# EasyEDA Pro project New Project_2024-09-24_23-01-51.eprj

# Schematic Schematic1
Create Date: 2024-09-24; Page Name: P1; Project Name: New Project_2024-09-24_23-01-51; Schematic Name: Schematic1; Update Date: 2024-09-25; Company: 嘉立创EDA; Page Size: A4; Version: V1.0
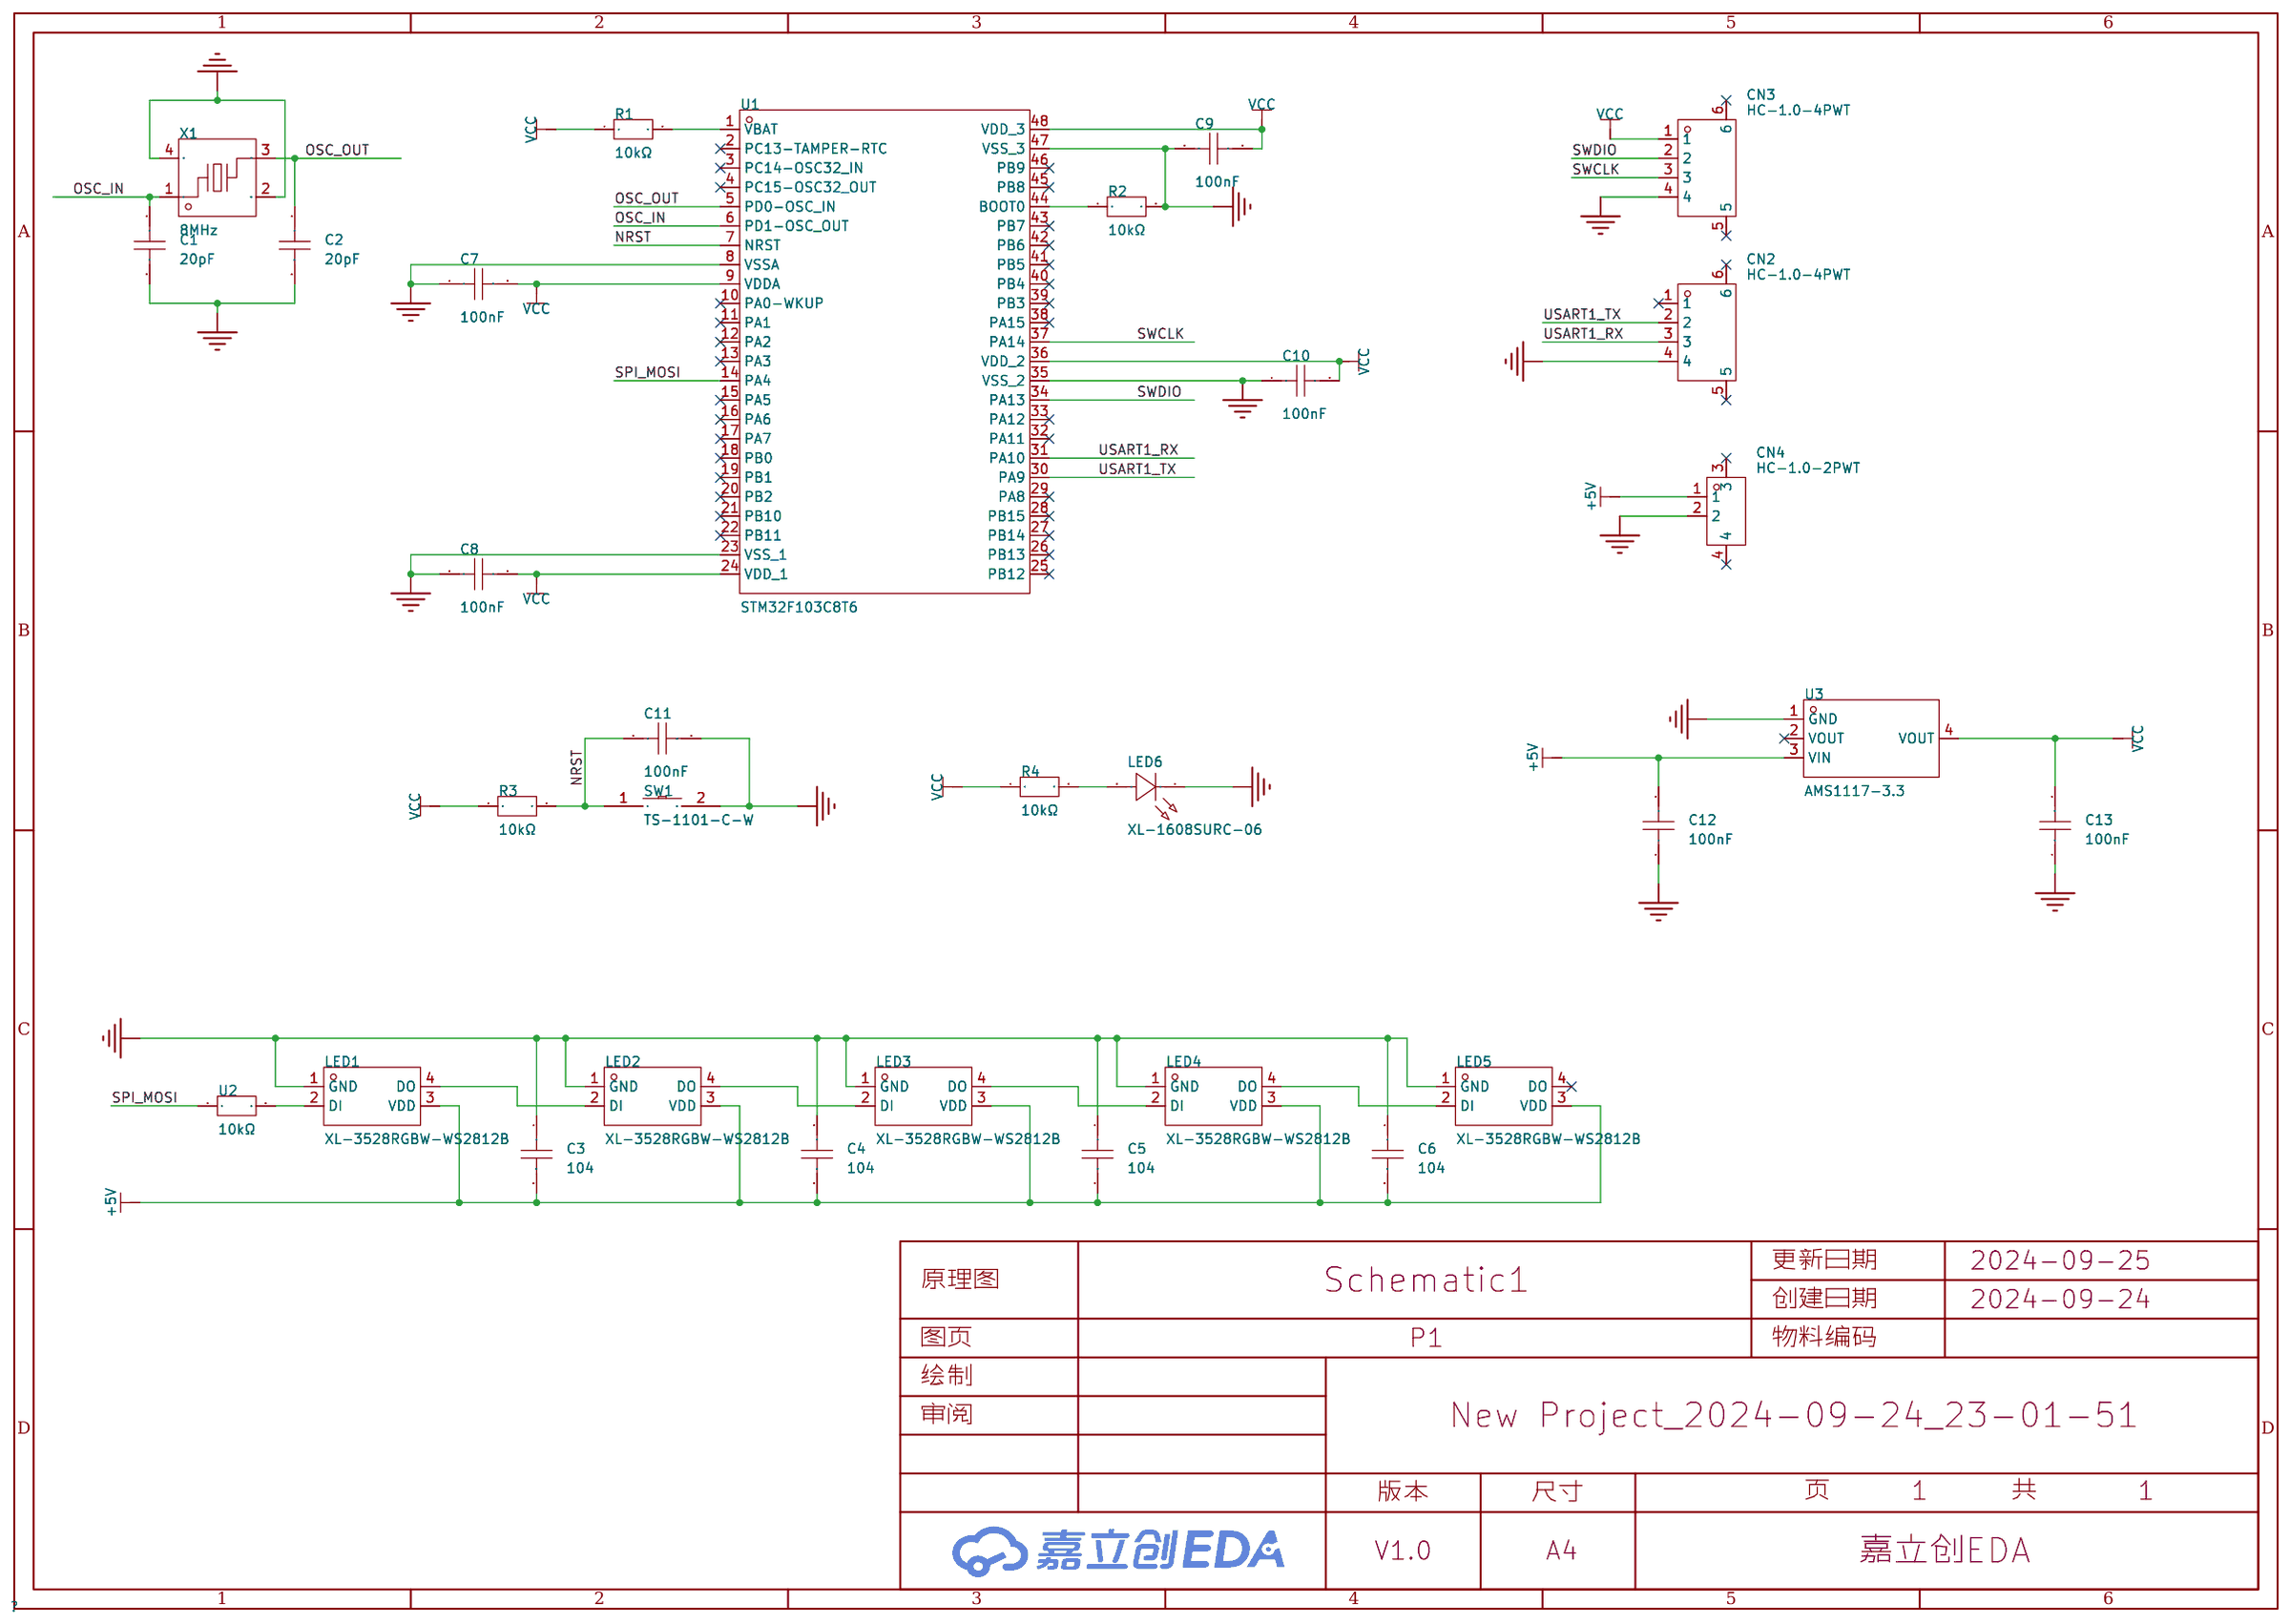
[diagram p0: schematic sheet]

## Parts
C1  20pF  [C0603]
C2  20pF  [C0603]
C3  104  [C0603]
C4  104  [C0603]
C5  104  [C0603]
C6  104  [C0603]
C7  100nF  [C0603]
C8  100nF  [C0603]
C9  100nF  [C0603]
C10  100nF  [C0603]
C11  100nF  [C0603]
C12  100nF  [C0603]
C13  100nF  [C0603]
CN2  HC-1.0-4PWT  [CONN-SMD_4P-P1.00_HCTL_HC-1.0-4PWT]
CN3  HC-1.0-4PWT  [CONN-SMD_4P-P1.00_HCTL_HC-1.0-4PWT]
CN4  HC-1.0-2PWT  [CONN-SMD_HC-1.0-2PWT]
LED1  XL-3528RGBW-WS2812B  [LED-SMD_4P-L3.5-W2.8-BR-1]
LED2  XL-3528RGBW-WS2812B  [LED-SMD_4P-L3.5-W2.8-BR-1]
LED3  XL-3528RGBW-WS2812B  [LED-SMD_4P-L3.5-W2.8-BR-1]
LED4  XL-3528RGBW-WS2812B  [LED-SMD_4P-L3.5-W2.8-BR-1]
LED5  XL-3528RGBW-WS2812B  [LED-SMD_4P-L3.5-W2.8-BR-1]
LED6  XL-1608SURC-06  [LED0603-RD_RED]
R1  10kΩ  [R0603]
R2  10kΩ  [R0603]
R3  10kΩ  [R0603]
R4  10kΩ  [R0603]
SW1  TS-1101-C-W  [SW-SMD_L6.0-W3.3-LS8.0]
U1  STM32F103C8T6  [LQFP-48_L7.0-W7.0-P0.50-LS9.0-BL]
U2  10kΩ  [R0603]
U3  AMS1117-3.3  [SOT-223-3_L6.5-W3.4-P2.30-LS7.0-BR]
X1  8MHz  [OSC-SMD_4P-L3.2-W2.5-BL]

## Library data of the parts
C1-C13 = CGA0603X7R104K500JT: 容值:100nF;精度:±10%;额定电压:50V;材质(温度系数):X7R;; LCSC Part Name: 100nF ±10% 50V; Supplier Part: C6119867; Manufacturer: HRE(芯声); Supplier Footprint: 0603; Supplier: LCSC; Tolerance: ±10%; Voltage Rated: 50V; Temperature Coefficient: X7R
CN2 CN3 = HC-1.0-4PWT: 插针结构:1x4P;间距:1mm;安装方式:卧贴;参考系列:-;总PIN数:4P;排数:1;每排PIN数:4;行距:-;额定电流:1A;触头材质:磷青铜;触头镀层:锡;工作温度范围:-25℃~+85℃;; LCSC Part Name: 1x4P 间距:1mm 卧贴; Supplier Part: C2845363; Manufacturer: HCTL(华灿天禄); Supplier Footprint: SMD,P=1mm,卧贴; Datasheet: https://atta.szlcsc.com/upload/public/pdf/source/20230707/696F47DD5B3D5495B4AB8BCE302E8A84.pdf; Supplier: LCSC; Pins Structure: 1x4P; Pitch: 1mm; Mounting Style: 卧贴; Number of Pins: 4P; Number of Rows: 1; Number of PINs Per Row: 4; Current Rating (Max): 1A; Contact Material: 磷青铜; Contact Plating: 锡; Operating Temperature Range: -25℃~+85℃
CN4 = HC-1.0-2PWT: 插针结构:1x2P;间距:1mm;安装方式:卧贴;参考系列:-;总PIN数:2P;排数:1;每排PIN数:2;行距:-;额定电流:1A;触头材质:磷青铜;触头镀层:锡;工作温度范围:-25℃~+85℃;; LCSC Part Name: 1x2P 间距:1mm 卧贴; Supplier Part: C2845361; Manufacturer: HCTL(华灿天禄); Supplier Footprint: SMD,P=1mm,卧贴; Datasheet: https://atta.szlcsc.com/upload/public/pdf/source/20230707/696F47DD5B3D5495B4AB8BCE302E8A84.pdf; Supplier: LCSC; Pins Structure: 1x2P; Pitch: 1mm; Mounting Style: 卧贴; Number of Pins: 2P; Number of Rows: 1; Number of PINs Per Row: 2; Current Rating (Max): 1A; Contact Material: 磷青铜; Contact Plating: 锡; Operating Temperature Range: -25℃~+85℃
LED1-LED5 = XL-3528RGBW-WS2812B: 3528 七彩幻彩雾状 ws2812B 内置驱动IC; Supplier Part: C2890364; Manufacturer: XINGLIGHT(成兴光); Supplier Footprint: SMD3528-4P; Datasheet: https://atta.szlcsc.com/upload/public/pdf/source/20240218/041E1E0D0024617DFFF124D9C311BB4D.pdf; Supplier: LCSC
LED6 = XL-1608SURC-06: 发光颜色:红色;功率:55mW;正向电流:25mA;主波长:617nm~621nm;透镜颜色:无色透明透镜;色温:-;发光角度:120°;载带方式:正贴;工作温度:-30℃~+85℃;; Supplier Part: C965799; Manufacturer: XINGLIGHT(成兴光); Supplier Footprint: 0603; Datasheet: https://atta.szlcsc.com/upload/public/pdf/source/20221102/D860AFDD1CDB02C5A8064103A32707E2.pdf; Supplier: LCSC; Emitted Color: 红色; Power Dissipation: 55mW; Forward Current: 25mA; Dominant Wavelength: 617nm~621nm; Peak Wavelength: 623nm; Lens Color: 无色透明透镜; Viewing Angle: 120°; Mounting Sytle: 正贴; Operating Temperature: -30℃~+85℃
R1-R4 = FRC0603J472 TS: 电阻类型:厚膜电阻;阻值:4.7kΩ;精度:±5%;功率:100mW;最大工作电压:75V;温度系数:±100ppm/℃;; LCSC Part Name: 4.7kΩ ±5% 100mW 厚膜电阻; Supplier Part: C2907166; Manufacturer: FOJAN(富捷); Supplier Footprint: 0603; Datasheet: https://atta.szlcsc.com/upload/public/pdf/source/20211221/925EC7D7225764EE0046F22065062C87.pdf; Supplier: LCSC; Type: 厚膜电阻; Tolerance: ±5%; Power(Watts): 100mW; Overload Voltage (Max): 75V; Temperature Coefficient: ±100ppm/℃; Operating Temperature Range: -55℃~+155℃
SW1 = TS-1101-C-W: 电路结构:单刀单掷;按钮形状:矩形按钮;作用力:260gf;安装方式:立贴;开关长度:6mm;开关宽度:3.6mm;开关高度:2.5mm;带支架:不带;触点电流:50mA;额定电压(AC):-;额定电压(DC):12V;额定功率:-;绝缘电阻:-;带灯:无;机械寿命:5万次;; LCSC Part Name: 6*3.6*2.5mm 立贴 轻触开关; Supplier Part: C318938; Manufacturer: XKB Connectivity(中国星坤); Supplier Footprint: SMD; Datasheet: https://atta.szlcsc.com/upload/public/pdf/source/20200227/C318938_C2E53B1EEDE37D980A33616AC086DE53.pdf; Supplier: LCSC; Circuit: 单刀单掷; Actuator Style: 矩形按钮; Operating Force: 260gf; Mounting Style: 立贴; Switch Length: 6mm; Switch Width: 3.6mm; Switch Height: 2.5mm; Strike Gundam: 不带; Contact Current: 50mA; Voltage Rating (DC): 12V; Actuator/Cap Color: 白色带淡绿; With Lamp: 无; Mechanical Life: 5万次; Operating Temperature: -30℃~+85℃
U1 = STM32F103C8T6: CPU内核:ARM-M3;程序存储容量:64KB;RAM总容量:20KB;GPIO端口数量:37;工作电压范围:2V~3.6V;CPU最大主频:72MHz;程序存储器类型:FLASH;; LCSC Part Name: 主流增强型ARM Cortex-M3 MCU，具有64 KB Flash、72 MHz CPU、电机控制、USB和CAN; Supplier Part: C8734; Manufacturer: ST(意法半导体); Supplier Footprint: LQFP-48(7x7); Datasheet: https://atta.szlcsc.com/upload/public/pdf/source/20220812/8363ACEC51AD55ECEB84799464F7CB85.pdf; Supplier: LCSC; CPU Core: ARM-M3; Program Storage Size: 64KB; RAM Size: 20KB; GPIO Ports Number: 37; Operating Voltage Range: 2V~3.6V; CPU Maximum Speed: 72MHz; Program Memory Type: FLASH; Operating Temperature Range: -40℃~+85℃; ADC (Bit): 12bit; Universal Serial Bus: 有; Peripheral/Function: 看门狗；DMA；看门狗；温度传感器; Watchdog: 有; Infrared Data Association: 有; Low-Voltage Detect: 有; Direct Memory Access: 有; Internal Oscillator: 有
U2 = FRC0603F3903TS: 电阻类型:厚膜电阻;阻值:390kΩ;精度:±1%;功率:100mW;最大工作电压:75V;温度系数:±100ppm/℃;; LCSC Part Name: 390kΩ ±1% 100mW 厚膜电阻; Supplier Part: C2907030; Manufacturer: FOJAN(富捷); Supplier Footprint: 0603; Datasheet: https://atta.szlcsc.com/upload/public/pdf/source/20211221/925EC7D7225764EE0046F22065062C87.pdf; Supplier: LCSC; Type: 厚膜电阻; Tolerance: ±1%; Power(Watts): 100mW; Overload Voltage (Max): 75V; Temperature Coefficient: ±100ppm/℃; Operating Temperature Range: -55℃~+155℃
U3 = AMS1117-3.3_C6186: 输出类型:固定;最大输入电压:-;输出电压:3.3V;最大输出电流:1A;电源纹波抑制比(PSRR):72dB@(120Hz);输出极性:正极;; LCSC Part Name: 输出3.3V 1A; Supplier Part: C6186; Manufacturer: AMS; Supplier Footprint: SOT-223; Datasheet: https://atta.szlcsc.com/upload/public/pdf/source/20180727/C6186_7A095716F0823C02F1997A905E26C086.pdf; Supplier: LCSC; Output Type: 固定; Output Voltage: 3.3V; MAX Output Current: 1A; Power Supply Rejection Ratio (PSRR): 72dB@(120Hz); Dropout Voltage: 1.3V@(800mA); Output Polarity: 正极; Number of Outputs: 1
X1 = X32258MOB4SI: 晶振类型:贴片晶振;频率:8MHz;常温频差:±10ppm;外接负载电容:12pF;频率稳定度(全温):±20ppm;; LCSC Part Name: 8MHz ±10ppm 12pF; Supplier Part: C2682775; Manufacturer: YXC(扬兴晶振); Supplier Footprint: SMD3225-4P; Datasheet: https://atta.szlcsc.com/upload/public/pdf/source/20240329/19D5F850207469550BEB00D7DFEDBC7A.pdf; Supplier: LCSC; Crystal Type: 贴片晶振; Normal temperature Frequency Tolerance: ±10ppm; External load capacitor: 12pF; Frequency Stability(Full temperature range): ±20ppm; Equivalent Series Resistance (ESR): 150Ω; Operating Temperature: -40℃~+85℃

## Nets
+5V: C3.2 C4.2 C5.2 C6.2 C12.2 CN4.1 LED1.3(VDD) LED2.3(VDD) LED3.3(VDD) LED4.3(VDD) LED5.3(VDD) U3.3(VIN)
GND: C1.2 C2.2 C3.1 C4.1 C5.1 C6.1 C7.1 C8.1 C9.1 C10.1 C11.2 C12.1 C13.1 CN2.4 CN3.4 CN4.2 LED1.1(GND) LED2.1(GND) LED3.1(GND) LED4.1(GND) LED5.1(GND) LED6.1(K) R2.2 SW1.2 U1.8(VSSA) U1.23(VSS_1) U1.35(VSS_2) U1.47(VSS_3) U3.1(GND) X1.2(GND) X1.4(GND)
VCC: C7.2 C8.2 C9.2 C10.2 C13.2 CN3.1 R1.1 R3.1 R4.1 U1.9(VDDA) U1.24(VDD_1) U1.36(VDD_2) U1.48(VDD_3) U3.4(VOUT)
NRST: C11.1 R3.2 SW1.1 U1.7(NRST)
OSC_IN: C1.1 U1.6(PD1-OSC_OUT) X1.1
OSC_OUT: C2.1 U1.5(PD0-OSC_IN) X1.3
SPI_MOSI: U1.14(PA4) U2.1
SWCLK: CN3.3 U1.37(PA14)
SWDIO: CN3.2 U1.34(PA13)
USART1_RX: CN2.3 U1.31(PA10)
USART1_TX: CN2.2 U1.30(PA9)
$1N1370: LED1.4(DO) LED2.2(DI)
$1N1375: LED2.4(DO) LED3.2(DI)
$1N1387: LED4.4(DO) LED5.2(DI)
$1N1405: LED3.4(DO) LED4.2(DI)
$1N2023: LED1.2(DI) U2.2
$1N3413: R1.2 U1.1(VBAT)
$1N3660: R2.1 U1.44(BOOT0)
Net-(LED6-2): LED6.2(A) R4.2

Not connected (* = marked no-connect by the designer): CN2 1* 5* 6*; CN3 5* 6*; CN4 3* 4*; LED5 4(DO)*; U1 2(PC13-TAMPER-RTC)* 3(PC14-OSC32_IN)* 4(PC15-OSC32_OUT)* 10(PA0-WKUP)* 11(PA1)* 12(PA2)* 13(PA3)* 15(PA5)* 16(PA6)* 17(PA7)* 18(PB0)* 19(PB1)* 20(PB2)* 21(PB10)* 22(PB11)* 25(PB12)* 26(PB13)* 27(PB14)* 28(PB15)* 29(PA8)* 32(PA11)* 33(PA12)* 38(PA15)* 39(PB3)* 40(PB4)* 41(PB5)* 42(PB6)* 43(PB7)* 45(PB8)* 46(PB9)*; U3 2(VOUT)*

# Board PCB1
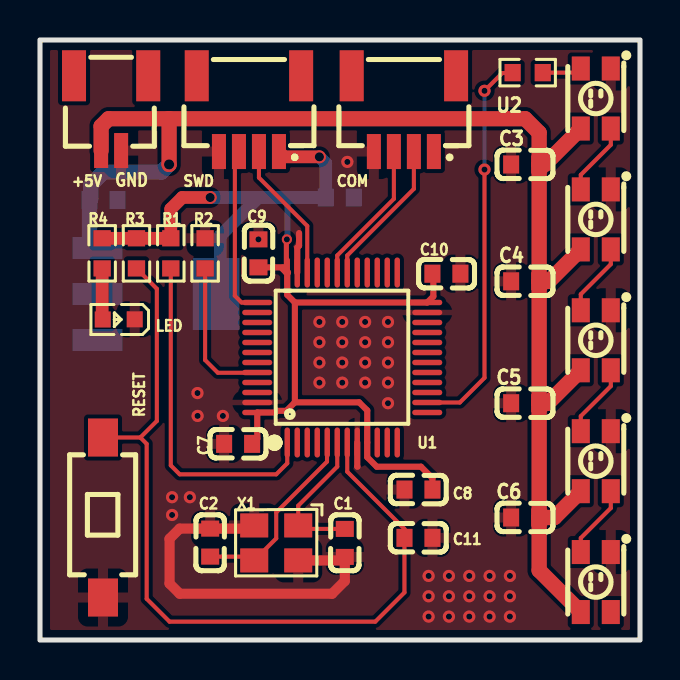
[diagram p1: board, top side]
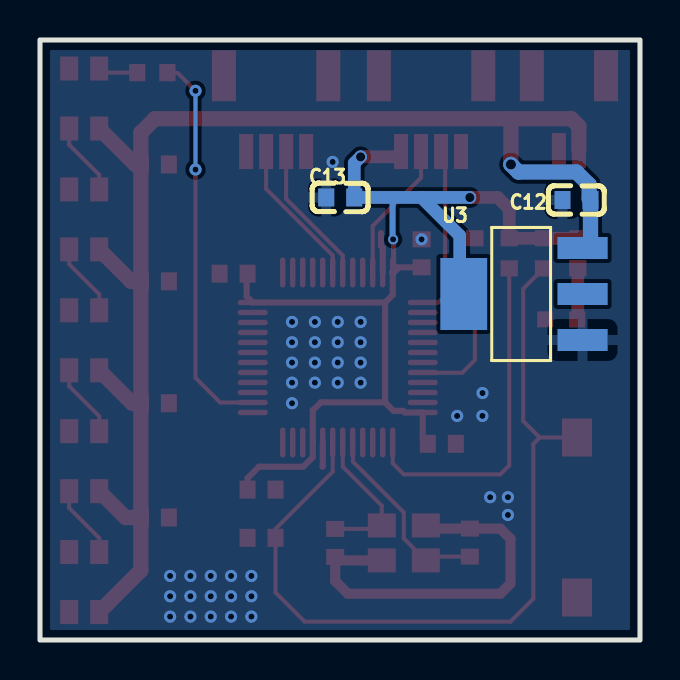
[diagram p2: board, bottom side, seen from below]

Outline 30 x 30 mm; copper layers: Top Layer, Bottom Layer. Coordinates in mm from the lower left corner of the outline.
Outline path: rectangle 0,30 30,0
Stack: Top Layer 0.035mm / Dielectric1 1.51mm FR4 er 4.5 / Bottom Layer 0.035mm

## Design rules (mm)
template: JLCPCB Capability(Two Layers Board)
spacing copperThickness1oz (default): track to track 0.102, other pairs 0.152 to 0.3
spacing copperThickness2oz: track to track 0.203, other pairs 0.152 to 0.3
track width copperThickness1oz (default): min 0.127, default 0.254, max 2.54
track width copperThickness2oz: min 0.203, default 0.254, max 2.54
differential pair differentialPair (default): width min 0.127, default 0.254, max 2.54; gap min 0.152, default 0.152
via viaSize (default): diameter min 0.5, default 0.61, max 10; hole min 0.3, default 0.305, max 6.3

## Placement (name value [footprint] x y rotation side)
+5V  HC-1.0-2PWT  [CONN-SMD_HC-1.0-2PWT]  3.56 26.34 180 top
C1  20pF  [C0603]  15.24 4.85 270 top
C2  20pF  [C0603]  8.51 4.87 90 top
C3  104  [C0603]  24.26 23.78 0 top
C4  104  [C0603]  24.26 17.94 0 top
C5  104  [C0603]  24.26 11.84 0 top
C6  104  [C0603]  24.26 6.12 0 top
C7  100nF  [C0603]  9.91 9.81 0 top
C8  100nF  [C0603]  18.92 7.52 0 top
C9  100nF  [C0603]  10.92 19.33 270 top
C10  100nF  [C0603]  20.32 18.32 180 top
C11  100nF  [C0603]  18.92 5.11 0 top
C12  100nF  [C0603]  3.18 22 180 bottom
C13  100nF  [C0603]  14.99 22.13 180 bottom
COM  HC-1.0-4PWT  [CONN-SMD_4P-P1.00_HCTL_HC-1.0-4PWT]  18.19 26.32 180 top
LED  XL-1608SURC-06  [LED0603-RD_RED]  3.94 16.03 180 top
LED1  XL-3528RGBW-WS2812B  [LED-SMD_4P-L3.5-W2.8-BR-1]  27.79 27.07 90 top
LED2  XL-3528RGBW-WS2812B  [LED-SMD_4P-L3.5-W2.8-BR-1]  27.79 21.03 90 top
LED3  XL-3528RGBW-WS2812B  [LED-SMD_4P-L3.5-W2.8-BR-1]  27.79 14.99 90 top
LED4  XL-3528RGBW-WS2812B  [LED-SMD_4P-L3.5-W2.8-BR-1]  27.79 8.94 90 top
LED5  XL-3528RGBW-WS2812B  [LED-SMD_4P-L3.5-W2.8-BR-1]  27.79 2.9 90 top
R1  10kΩ  [R0603]  6.54 19.33 270 top
R2  10kΩ  [R0603]  8.25 19.33 90 top
R3  10kΩ  [R0603]  4.82 19.33 270 top
R4  10kΩ  [R0603]  3.11 19.33 270 top
RESET  TS-1101-C-W  [SW-SMD_L6.0-W3.3-LS8.0]  3.15 6.12 270 top
SWD  HC-1.0-4PWT  [CONN-SMD_4P-P1.00_HCTL_HC-1.0-4PWT]  10.45 26.32 180 top
U1  STM32F103C8T6  [LQFP-48_L7.0-W7.0-P0.50-LS9.0-BL]  15.11 14.12 0 top
U2  10kΩ  [R0603]  24.38 28.37 0 top
U3  AMS1117-3.3  [SOT-223-3_L6.5-W3.4-P2.30-LS7.0-BR]  5.84 17.3 180 bottom
X1  8MHz  [OSC-SMD_4P-L3.2-W2.5-BL]  11.81 4.85 180 top

## Footprints (pads in the part's own frame, mm; a bottom-side part is the same pattern mirrored in y, then rotated)
C0603
  rect 0.8x0.9 smd: 1(-0.7,0) 2(0.7,0)
CONN-SMD_4P-P1.00_HCTL_HC-1.0-4PWT
  rect 0.7x1.75 smd: 1(-1.5,1.895) 2(-0.5,1.895) 3(0.5,1.895) 4(1.5,1.895)
  rect 1.2x2.55 smd: 5(2.61,-1.895) 6(-2.61,-1.895)
CONN-SMD_HC-1.0-2PWT
  rect 0.7x1.75 smd: 1(0.5,1.87) 2(-0.5,1.87)
  rect 1.2x2.55 smd: 3(-1.855,-1.87) 4(1.855,-1.87)
LED0603-RD_RED
  rect 0.8x0.8 smd: 1(-0.799,-0.004) 2(0.799,0.004)
LED-SMD_4P-L3.5-W2.8-BR-1
  rect 1.2x0.9 smd: 1(1.5,-0.75) 2(1.5,0.75) 3(-1.5,0.75) 4(-1.5,-0.75)
LQFP-48_L7.0-W7.0-P0.50-LS9.0-BL
  oval 0.27x1.5 smd: 1(-2.75,-4.25) 2(-2.25,-4.25) 3(-1.75,-4.25) 4(-1.25,-4.25) 5(-0.75,-4.25) 6(-0.25,-4.25) 7(0.25,-4.25) 8(0.75,-4.25) 9(1.25,-4.25) 10(1.75,-4.25) 11(2.25,-4.25) 12(2.75,-4.25) 25(2.75,4.25) 26(2.25,4.25) 27(1.75,4.25) 28(1.25,4.25) 29(0.75,4.25) 30(0.25,4.25) 31(-0.25,4.25) 32(-0.75,4.25) 33(-1.25,4.25) 34(-1.75,4.25) 35(-2.25,4.25) 36(-2.75,4.25)
  oval 1.5x0.27 smd: 13(4.25,-2.75) 14(4.25,-2.25) 15(4.25,-1.75) 16(4.25,-1.25) 17(4.25,-0.75) 18(4.25,-0.25) 19(4.25,0.25) 20(4.25,0.75) 21(4.25,1.25) 22(4.25,1.75) 23(4.25,2.25) 24(4.25,2.75) 37(-4.25,2.75) 38(-4.25,2.25) 39(-4.25,1.75) 40(-4.25,1.25) 41(-4.25,0.75) 42(-4.25,0.25) 43(-4.25,-0.25) 44(-4.25,-0.75) 45(-4.25,-1.25) 46(-4.25,-1.75) 47(-4.25,-2.25) 48(-4.25,-2.75)
OSC-SMD_4P-L3.2-W2.5-BL
  rect 1.4x1.2 smd: 1(-1.1,-0.875) 2(1.1,-0.875) 3(1.1,0.875) 4(-1.1,0.875)
R0603
  rect 0.806x0.864 smd: 1(-0.753,0) 2(0.753,0)
SOT-223-3_L6.5-W3.4-P2.30-LS7.0-BR
  rect 2.5x1.1 smd: 1(2.97,-2.3) 2(2.97,0) 3(2.97,2.3)
  rect 2.34x3.6 smd: 4(-2.97,0)
SW-SMD_L6.0-W3.3-LS8.0
  rect 1.9x1.5 smd: 1(-4,0) 2(4,0)

## Nets
+5V: +5V.1 C3.2 C4.2 C5.2 C6.2 C12.2 LED1.3 LED2.3 LED3.3 LED4.3 LED5.3 U3.3
GND: +5V.2 C1.2 C2.2 C3.1 C4.1 C5.1 C6.1 C7.1 C8.1 C9.1 C10.1 C11.2 C12.1 C13.1 COM.4 LED.1 LED1.1 LED2.1 LED3.1 LED4.1 LED5.1 R2.2 RESET.2 SWD.4 U1.8 U1.23 U1.35 U1.47 U3.1 X1.2 X1.4
VCC: C7.2 C8.2 C9.2 C10.2 C13.2 R1.1 R3.1 R4.1 SWD.1 U1.9 U1.24 U1.36 U1.48 U3.4
NRST: C11.1 R3.2 RESET.1 U1.7
OSC_IN: C1.1 U1.6 X1.1
OSC_OUT: C2.1 U1.5 X1.3
SPI_MOSI: U1.14 U2.1
SWCLK: SWD.3 U1.37
SWDIO: SWD.2 U1.34
USART1_RX: COM.3 U1.31
USART1_TX: COM.2 U1.30
$1N1370: LED1.4 LED2.2
$1N1375: LED2.4 LED3.2
$1N1387: LED4.4 LED5.2
$1N1405: LED3.4 LED4.2
$1N2023: LED1.2 U2.2
$1N3413: R1.2 U1.1
$1N3660: R2.1 U1.44
$1N4511: LED.2 R4.2

Pads without a net: +5V 3 4; COM 1 5 6; LED5 4; SWD 5 6; U1 2 3 4 10 11 12 13 15 16 17 18 19 20 21 22 25 26 27 28 29 32 33 38 39 40 41 42 43 45 46; U3 2

## Via types
v1: diameter 0.61, hole 0.305, Top Layer to Bottom Layer, 42 vias
v2: diameter 0.762, hole 0.508, Top Layer to Bottom Layer, 1 via
v3: diameter 0.508, hole 0.305, Top Layer to Bottom Layer, 1 via
v4: diameter 0.635, hole 0.457, Top Layer to Bottom Layer, 2 vias

## Routing (per net, layer and track width the routed paths; a pad name or vN(x,y) marks a point on that pad's centre or on a via; arc(x,y) is an arc through that point)
+5V: length 69.3
  Top Layer w0.762: C5.2 C6.2 ; C5.2 C4.2 ; C5.2 25.39,11.84 LED3.3 ; C6.2 24.96,3.48 LED5.3 ; C6.2 25.72,6.12 LED4.3 ; C3.2 24.96,25.36 24.26,26.06 6.46,26.06 ; C3.2 25.24,23.78 LED1.3 ; C3.2 C4.2 ; C4.2 25.44,17.94 LED2.3 ; 6.46,26.06 v2(6.46,23.78) ; 6.46,26.06 3.43,26.06 3.06,25.69 +5V.1
  Bottom Layer w0.762: U3.3 2.47,20 2.47,22 2.54,22.06 2.54,22.76 3.18,23.4 6.07,23.4 v2(6.46,23.78)
GND: length 22.8
  Top Layer w0.305: 12.95,20.35 12.95,19.71 12.86,19.62 U1.35 ; U1.8 15.86,8.68 15.88,8.66
  Top Layer w0.508: X1.4 15.06,3.98 C1.2 15.24,2.95 14.6,2.31 6.98,2.31 6.48,2.82 6.48,5.06 6.98,5.57 C2.2 10.55,5.57 X1.2
  vias: v1(6.6,7.14) v1(6.6,6.25) v1(7.49,7.14) v1(7.87,12.35) v1(7.88,11.2) v1(9.14,11.2) v1(10.92,20.03) v1(13.97,15.9) v1(13.97,14.89) v1(13.97,13.87) v1(13.97,12.87) v1(15.11,15.9) v1(15.11,14.89) v1(15.11,13.87) v1(15.11,12.87) v1(15.37,23.9) v1(16.26,15.9) v1(16.26,14.89) v1(16.26,13.87) v1(16.26,12.87) v1(17.4,15.9) v1(17.4,14.89) v1(17.4,13.87) v1(17.4,12.87) v1(17.4,11.84) v1(19.43,3.2) v1(19.43,2.19) v1(19.43,1.17) v1(20.45,3.2) v1(20.45,2.19) v1(20.45,1.17) v1(21.46,3.2) v1(21.46,2.19) v1(21.46,1.17) v1(22.48,3.2) v1(22.48,2.19) v1(22.48,1.17) v1(23.5,3.2) v1(23.5,2.19) v1(23.5,1.17)
VCC: length 57.1
  Top Layer w0.254: 12.32,20.09 12.32,18.42
  Top Layer w0.305: 12.74,16.88 12.74,11.88 ; 12.74,16.88 U1.24 19.67,17.18 19.67,18.27 C10.2 ; 12.74,16.88 12.36,17.26 U1.36 ; 12.74,11.88 12.32,11.46 11.85,11.46 11.77,11.38 U1.48 10.86,10.06 C7.2 ; 12.74,11.88 15.96,11.88 16.36,11.48 U1.9 16.36,9.14 16.84,8.66 19.05,8.66 19.62,8.09 C8.2 ; 12.15,18.63 C9.2
  Top Layer w0.381: 12.15,18.59 U1.36
  Top Layer w0.635: v4(8.51,22.13) 7.11,22.13 6.54,21.55 R1.1 R3.1 R4.1 ; SWD.1 12.21,24.16 v4(13.97,24.16)
  Bottom Layer w0.305: 12.32,20.09 12.37,20.15 12.37,22.13
  Bottom Layer w0.635: v4(8.51,22.13) 10.92,22.13 ; 10.92,22.13 C13.2 14.29,23.84 v4(13.97,24.16) ; 10.92,22.13 9.02,20.22 9.02,17.5 U3.4
  vias: v3(12.34,20.03)
NRST: length 41.9
  Top Layer w0.203: U1.7 15.36,8.41 18.22,5.55 C11.1 18.22,2.38 16.76,0.92 6.48,0.92 5.33,2.06 5.33,9.81 5.02,10.12 ; 5.02,10.12 5.84,10.95 5.84,17.56 R3.2 ; 5.02,10.12 RESET.1
OSC_IN: length 7.4
  Top Layer w0.203: C1.1 13.09,5.55 X1.1 12.91,6.72 14.86,8.67 U1.6
OSC_OUT: length 9.7
  Top Layer w0.203: U1.5 14.35,9.86 14.35,8.92 11.81,6.38 11.81,5.08 X1.3 10.52,4.17 C2.1
SPI_MOSI: length 19.5
  Top Layer w0.203: v1(22.22,23.52) 22.22,13.11 20.99,11.88 U1.14 ; U2.1 23.61,28.35 23.11,28.35 v1(22.22,27.46)
  Bottom Layer w0.203: v1(22.22,23.52) v1(22.22,27.46)
SWCLK: length 8.6
  Top Layer w0.203: U1.37 10.08,16.88 9.74,17.21 9.74,24.22 SWD.3
SWDIO: length 7
  Top Layer w0.203: U1.34 13.36,20.7 10.95,23.12 SWD.2
USART1_RX: length 7.2
  Top Layer w0.203: U1.31 14.86,19.23 17.69,22.06 COM.3
USART1_TX: length 7.4
  Top Layer w0.203: U1.30 15.36,19.23 18.69,22.56 COM.2
$1N1370: length 3.7
  Top Layer w0.203: LED2.2 27.04,23.26 28.54,24.76 LED1.4
$1N1375: length 3.7
  Top Layer w0.203: LED2.4 28.54,18.79 27.04,17.29 LED3.2
$1N1387: length 3.7
  Top Layer w0.203: LED5.2 27.04,5.1 28.54,6.6 LED4.4
$1N1405: length 3.7
  Top Layer w0.203: LED4.2 27.04,11.19 28.54,12.69 LED3.4
$1N2023: length 2
  Top Layer w0.203: U2.2 26.84,28.37 LED1.2
$1N3413: length 17.1
  Top Layer w0.203: U1.1 12.36,8.83 11.81,8.28 6.98,8.28 6.54,8.73 R1.2
$1N3660: length 7.5
  Top Layer w0.203: R2.1 8.25,14 8.89,13.36 10.85,13.36 U1.44
$1N4511: length 2.6
  Top Layer w0.635: LED.2 3.11,16.06 R4.2

## Copper pours and planes (outline as drawn; the poured copper is in the pictures)
GND on Top Layer: 0.25,29.75 29.72,29.75 29.72,0.28 0.25,0.28
GND on Bottom Layer: 0.25,29.75 29.72,29.75 29.72,0.28 0.25,0.28

## Text on the board
Top Silkscreen Layer: GND
